# EAGLE schematic PGTN021_octasource_mkii_controls (EAGLE 9.6.0)
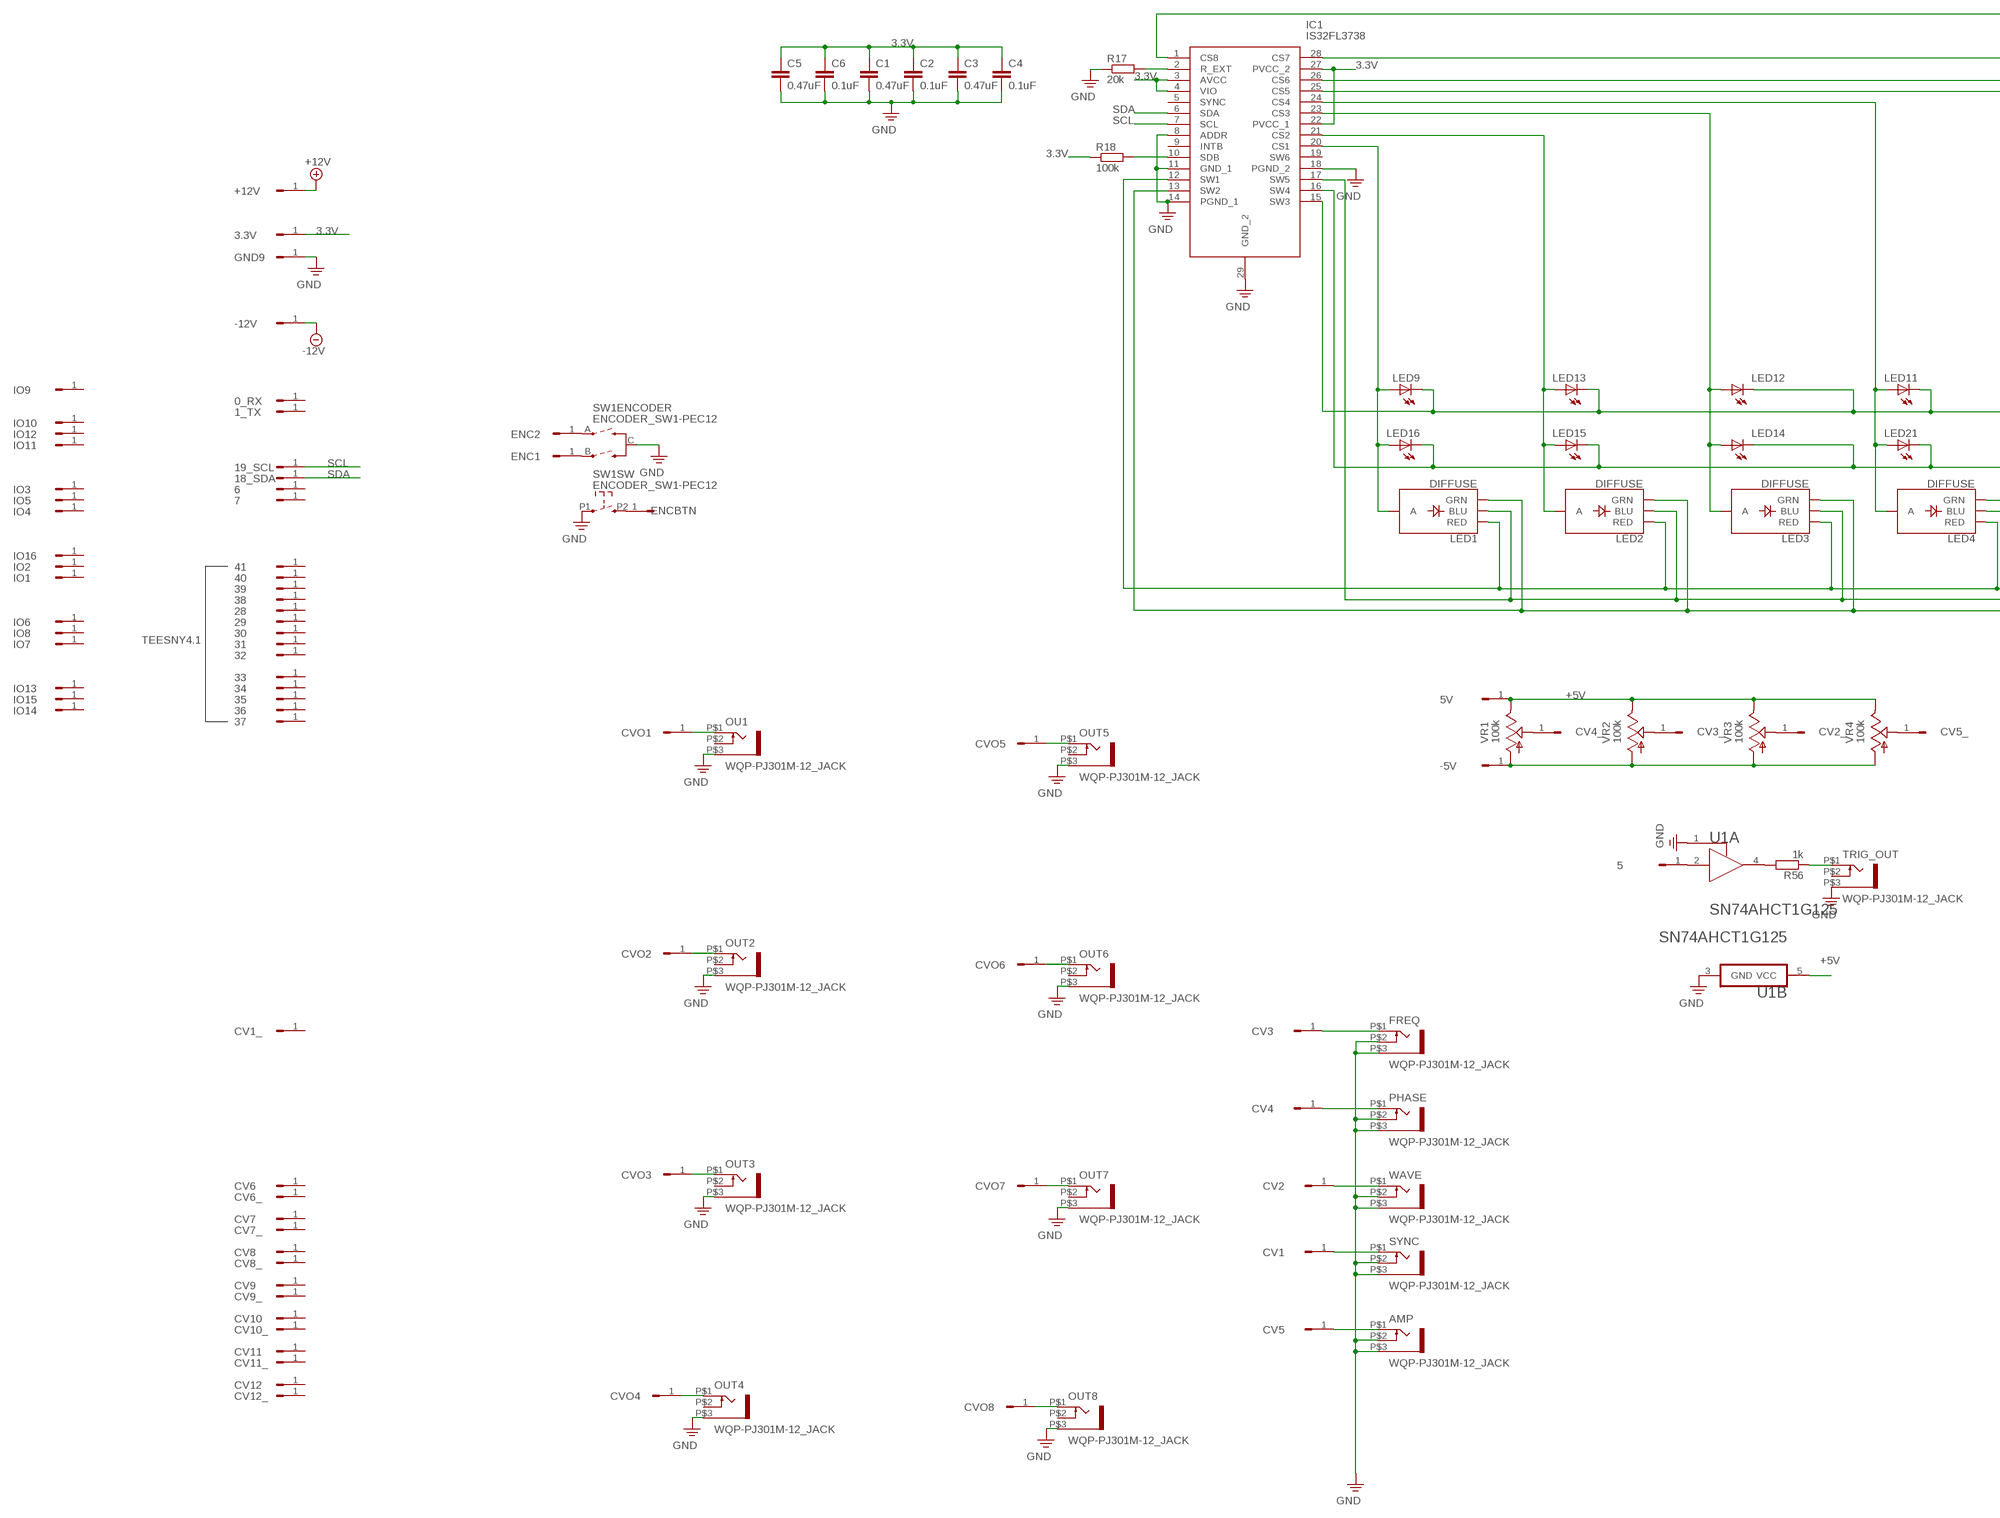
[diagram p0: schematic, sheet 1, part 1 of 2]
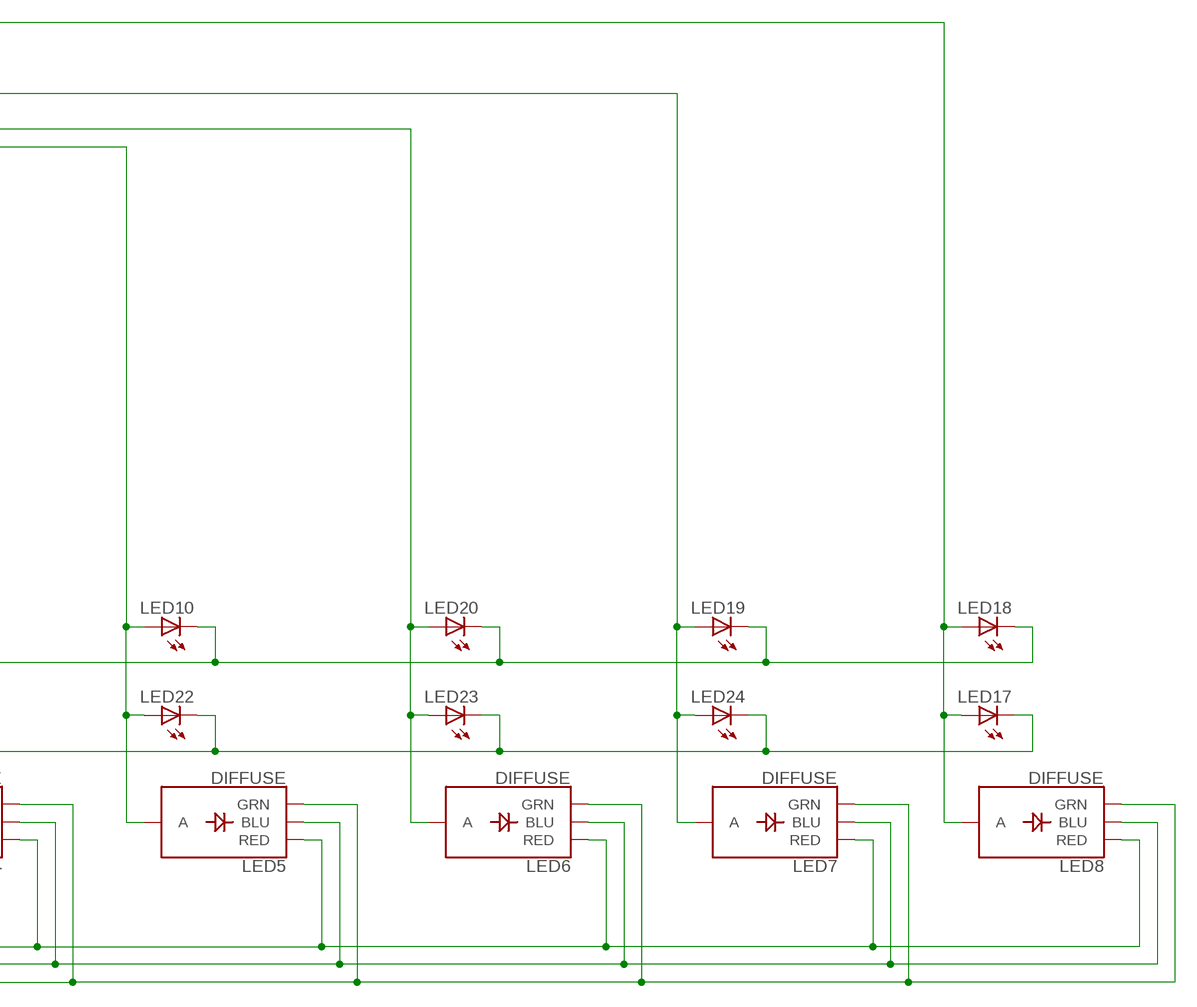
[diagram p1: schematic, sheet 1, part 2 of 2]

## Parts
0_RX  HEADER/MALE/01  [HEADER/MALE/01]
1_TX  HEADER/MALE/01  [HEADER/MALE/01]
3.3V  HEADER/MALE/01  [HEADER/MALE/01]
5  HEADER/MALE/01  [HEADER/MALE/01]
5V  HEADER/MALE/01  [HEADER/MALE/01]
6  HEADER/MALE/01  [HEADER/MALE/01]
7  HEADER/MALE/01  [HEADER/MALE/01]
18_SDA  HEADER/MALE/01  [HEADER/MALE/01]
19_SCL  HEADER/MALE/01  [HEADER/MALE/01]
28  HEADER/MALE/01  [HEADER/MALE/01]
29  HEADER/MALE/01  [HEADER/MALE/01]
30  HEADER/MALE/01  [HEADER/MALE/01]
31  HEADER/MALE/01  [HEADER/MALE/01]
32  HEADER/MALE/01  [HEADER/MALE/01]
33  HEADER/MALE/01  [HEADER/MALE/01]
34  HEADER/MALE/01  [HEADER/MALE/01]
35  HEADER/MALE/01  [HEADER/MALE/01]
36  HEADER/MALE/01  [HEADER/MALE/01]
37  HEADER/MALE/01  [HEADER/MALE/01]
38  HEADER/MALE/01  [HEADER/MALE/01]
39  HEADER/MALE/01  [HEADER/MALE/01]
40  HEADER/MALE/01  [HEADER/MALE/01]
41  HEADER/MALE/01  [HEADER/MALE/01]
+12V  HEADER/MALE/01  [HEADER/MALE/01]
-5V  HEADER/MALE/01  [HEADER/MALE/01]
-12V  HEADER/MALE/01  [HEADER/MALE/01]
AMP  WQP-PJ301M-12_JACK  [WQP-PJ301M-12_JACK]
C1  0.47uF  CAPACITORC0603  [C0603]
C2  0.1uF  CAPACITORC0603  [C0603]
C3  0.47uF  CAPACITORC0603  [C0603]
C4  0.1uF  CAPACITORC0603  [C0603]
C5  0.47uF  CAPACITORC0603  [C0603]
C6  0.1uF  CAPACITORC0603  [C0603]
CV1  HEADER/MALE/01  [HEADER/MALE/01]
CV1_  HEADER/MALE/01  [HEADER/MALE/01]
CV2  HEADER/MALE/01  [HEADER/MALE/01]
CV2_  HEADER/MALE/01  [HEADER/MALE/01]
CV3  HEADER/MALE/01  [HEADER/MALE/01]
CV3_  HEADER/MALE/01  [HEADER/MALE/01]
CV4  HEADER/MALE/01  [HEADER/MALE/01]
CV4_  HEADER/MALE/01  [HEADER/MALE/01]
CV5  HEADER/MALE/01  [HEADER/MALE/01]
CV5_  HEADER/MALE/01  [HEADER/MALE/01]
CV6  HEADER/MALE/01  [HEADER/MALE/01]
CV6_  HEADER/MALE/01  [HEADER/MALE/01]
CV7  HEADER/MALE/01  [HEADER/MALE/01]
CV7_  HEADER/MALE/01  [HEADER/MALE/01]
CV8  HEADER/MALE/01  [HEADER/MALE/01]
CV8_  HEADER/MALE/01  [HEADER/MALE/01]
CV9  HEADER/MALE/01  [HEADER/MALE/01]
CV9_  HEADER/MALE/01  [HEADER/MALE/01]
CV10  HEADER/MALE/01  [HEADER/MALE/01]
CV10_  HEADER/MALE/01  [HEADER/MALE/01]
CV11  HEADER/MALE/01  [HEADER/MALE/01]
CV11_  HEADER/MALE/01  [HEADER/MALE/01]
CV12  HEADER/MALE/01  [HEADER/MALE/01]
CV12_  HEADER/MALE/01  [HEADER/MALE/01]
CVO1  HEADER/MALE/01  [HEADER/MALE/01]
CVO2  HEADER/MALE/01  [HEADER/MALE/01]
CVO3  HEADER/MALE/01  [HEADER/MALE/01]
CVO4  HEADER/MALE/01  [HEADER/MALE/01]
CVO5  HEADER/MALE/01  [HEADER/MALE/01]
CVO6  HEADER/MALE/01  [HEADER/MALE/01]
CVO7  HEADER/MALE/01  [HEADER/MALE/01]
CVO8  HEADER/MALE/01  [HEADER/MALE/01]
ENC1  HEADER/MALE/01  [HEADER/MALE/01]
ENC2  HEADER/MALE/01  [HEADER/MALE/01]
ENCBTN  HEADER/MALE/01  [HEADER/MALE/01]
FREQ  WQP-PJ301M-12_JACK  [WQP-PJ301M-12_JACK]
GND9  HEADER/MALE/01  [HEADER/MALE/01]
IC1  IS32FL3738  [TSSOP29]
IO1  HEADER/MALE/01  [HEADER/MALE/01]
IO2  HEADER/MALE/01  [HEADER/MALE/01]
IO3  HEADER/MALE/01  [HEADER/MALE/01]
IO4  HEADER/MALE/01  [HEADER/MALE/01]
IO5  HEADER/MALE/01  [HEADER/MALE/01]
IO6  HEADER/MALE/01  [HEADER/MALE/01]
IO7  HEADER/MALE/01  [HEADER/MALE/01]
IO8  HEADER/MALE/01  [HEADER/MALE/01]
IO9  HEADER/MALE/01  [HEADER/MALE/01]
IO10  HEADER/MALE/01  [HEADER/MALE/01]
IO11  HEADER/MALE/01  [HEADER/MALE/01]
IO12  HEADER/MALE/01  [HEADER/MALE/01]
IO13  HEADER/MALE/01  [HEADER/MALE/01]
IO14  HEADER/MALE/01  [HEADER/MALE/01]
IO15  HEADER/MALE/01  [HEADER/MALE/01]
IO16  HEADER/MALE/01  [HEADER/MALE/01]
LED1  DIFFUSE  LED-RGB-CADIFFUSE  [LED-RGB-THRU]
LED2  DIFFUSE  LED-RGB-CADIFFUSE  [LED-RGB-THRU]
LED3  DIFFUSE  LED-RGB-CADIFFUSE  [LED-RGB-THRU]
LED4  DIFFUSE  LED-RGB-CADIFFUSE  [LED-RGB-THRU]
LED5  DIFFUSE  LED-RGB-CADIFFUSE  [LED-RGB-THRU]
LED6  DIFFUSE  LED-RGB-CADIFFUSE  [LED-RGB-THRU]
LED7  DIFFUSE  LED-RGB-CADIFFUSE  [LED-RGB-THRU]
LED8  DIFFUSE  LED-RGB-CADIFFUSE  [LED-RGB-THRU]
LED9  LEDCHIPLED_0805  [CHIPLED_0805]
LED10  LEDCHIPLED_0805  [CHIPLED_0805]
LED11  LEDCHIPLED_0805  [CHIPLED_0805]
LED12  LEDCHIPLED_0805  [CHIPLED_0805]
LED13  LEDCHIPLED_0805  [CHIPLED_0805]
LED14  LEDCHIPLED_0805  [CHIPLED_0805]
LED15  LEDCHIPLED_0805  [CHIPLED_0805]
LED16  LEDCHIPLED_0805  [CHIPLED_0805]
LED17  LEDCHIPLED_0805  [CHIPLED_0805]
LED18  LEDCHIPLED_0805  [CHIPLED_0805]
LED19  LEDCHIPLED_0805  [CHIPLED_0805]
LED20  LEDCHIPLED_0805  [CHIPLED_0805]
LED21  LEDCHIPLED_0805  [CHIPLED_0805]
LED22  LEDCHIPLED_0805  [CHIPLED_0805]
LED23  LEDCHIPLED_0805  [CHIPLED_0805]
LED24  LEDCHIPLED_0805  [CHIPLED_0805]
OU1  WQP-PJ301M-12_JACK  [WQP-PJ301M-12_JACK]
OUT2  WQP-PJ301M-12_JACK  [WQP-PJ301M-12_JACK]
OUT3  WQP-PJ301M-12_JACK  [WQP-PJ301M-12_JACK]
OUT4  WQP-PJ301M-12_JACK  [WQP-PJ301M-12_JACK]
OUT5  WQP-PJ301M-12_JACK  [WQP-PJ301M-12_JACK]
OUT6  WQP-PJ301M-12_JACK  [WQP-PJ301M-12_JACK]
OUT7  WQP-PJ301M-12_JACK  [WQP-PJ301M-12_JACK]
OUT8  WQP-PJ301M-12_JACK  [WQP-PJ301M-12_JACK]
PHASE  WQP-PJ301M-12_JACK  [WQP-PJ301M-12_JACK]
R17  20k  RESISTOR  [R0603]
R18  100k  RESISTOR  [R0603]
R56  1k  RESISTOR  [R0603]
SW1  ENCODER_SW1-PEC12  [PEC12_INCREMENTAL_ENCODER]
SYNC  WQP-PJ301M-12_JACK  [WQP-PJ301M-12_JACK]
TRIG_OUT  WQP-PJ301M-12_JACK  [WQP-PJ301M-12_JACK]
U1  74AHCT1G125"  [74AHCT1G125]
VR1  100k  9MM_SNAP-IN_POT_  [9MM_SNAP-IN_POT]
VR2  100k  9MM_SNAP-IN_POT_  [9MM_SNAP-IN_POT]
VR3  100k  9MM_SNAP-IN_POT_  [9MM_SNAP-IN_POT]
VR4  100k  9MM_SNAP-IN_POT_  [9MM_SNAP-IN_POT]
WAVE  WQP-PJ301M-12_JACK  [WQP-PJ301M-12_JACK]

## Nets
3.3V: 3.3V.1 C1.1 C2.1 C3.1 C4.1 C5.1 C6.1 IC1.3(AVCC) IC1.4(VIO) IC1.22(PVCC_1) IC1.27(PVCC_2) R18.1
+5V: 5V.1 U1.5(B:VCC) VR1.3(E) VR2.3(E) VR3.3(E) VR4.3(E)
+12V: +12V.1
-12V: -12V.1
N$1: IC1.12(SW1) LED1.1(RED) LED2.1(RED) LED3.1(RED) LED4.1(RED) LED5.1(RED) LED6.1(RED) LED7.1(RED) LED8.1(RED)
N$3: IC1.17(SW5) LED1.4(BLU) LED2.4(BLU) LED3.4(BLU) LED4.4(BLU) LED5.4(BLU) LED6.4(BLU) LED7.4(BLU) LED8.4(BLU)
N$4: CVO1.1 OU1.P$1
N$6: IC1.13(SW2) LED1.3(GRN) LED2.3(GRN) LED3.3(GRN) LED4.3(GRN) LED5.3(GRN) LED6.3(GRN) LED7.3(GRN) LED8.3(GRN)
N$8: CVO2.1 OUT2.P$1
N$12: CVO3.1 OUT3.P$1
N$16: CVO4.1 OUT4.P$1
N$20: CVO5.1 OUT5.P$1
N$24: CVO6.1 OUT6.P$1
N$28: CVO7.1 OUT7.P$1
N$32: CVO8.1 OUT8.P$1
N$33: IC1.10(SDB) R18.2
N$34: R56.2 U1.4(A:Y)
N$35: 5.1 U1.2(A:A)
N$36: ENCBTN.1 SW1.P2
N$37: ENC2.1 SW1.A(ENCODER:A)
N$38: ENC1.1 SW1.B(ENCODER:B)
N$39: CV1.1 SYNC.P$1
N$40: -5V.1 VR1.1(A) VR2.1(A) VR3.1(A) VR4.1(A)
N$41: CV2.1 WAVE.P$1
N$42: CV3.1 FREQ.P$1
N$43: CV4.1 PHASE.P$1
N$44: AMP.P$1 CV5.1
N$45: CV2_.1 VR3.2(S)
N$46: CV3_.1 VR2.2(S)
N$47: CV4_.1 VR1.2(S)
N$48: CV5_.1 VR4.2(S)
N$49: R56.1 TRIG_OUT.P$1
N$50: IC1.20(CS1) LED1.2(A) LED9.A LED16.A
N$51: IC1.21(CS2) LED2.2(A) LED13.A LED15.A
N$52: IC1.23(CS3) LED3.2(A) LED12.A LED14.A
N$62: IC1.16(SW4) LED14.C LED15.C LED16.C LED17.C LED21.C LED22.C LED23.C LED24.C
N$63: IC1.15(SW3) LED9.C LED10.C LED11.C LED12.C LED13.C LED18.C LED19.C LED20.C
N$65: IC1.24(CS4) LED4.2(A) LED11.A LED21.A
N$66: IC1.25(CS5) LED5.2(A) LED10.A LED22.A
N$67: IC1.26(CS6) LED6.2(A) LED20.A LED23.A
N$68: IC1.28(CS7) LED7.2(A) LED19.A LED24.A
N$69: IC1.1(CS8) LED8.2(A) LED17.A LED18.A
N$70: IC1.2(R_EXT) R17.2
PE: AMP.P$2 AMP.P$3 C1.2 C2.2 C3.2 C4.2 C5.2 C6.2 FREQ.P$2 FREQ.P$3 GND9.1 IC1.8(ADDR) IC1.11(GND_1) IC1.14(PGND_1) IC1.18(PGND_2) IC1.29(GND_2) OU1.P$3 OUT2.P$3 OUT3.P$3 OUT4.P$3 OUT5.P$3 OUT6.P$3 OUT7.P$3 OUT8.P$3 PHASE.P$2 PHASE.P$3 R17.1 SW1.C(ENCODER:C) SW1.P1 SYNC.P$2 SYNC.P$3 TRIG_OUT.P$3 U1.1(A:!OE!) U1.3(B:GND) WAVE.P$2 WAVE.P$3 ; supply symbol labelled GND
SCL: 19_SCL.1 IC1.7(SCL)
SDA: 18_SDA.1 IC1.6(SDA)
Unconnected: 0_RX.1 1_TX.1 6.1 7.1 28.1 29.1 30.1 31.1 32.1 33.1 34.1 35.1 36.1 37.1 38.1 39.1 40.1 41.1 CV1_.1 CV6.1 CV6_.1 CV7.1 CV7_.1 CV8.1 CV8_.1 CV9.1 CV9_.1 CV10.1 CV10_.1 CV11.1 CV11_.1 CV12.1 CV12_.1 IC1.5(SYNC) IC1.9(INTB) IC1.19(SW6) IO1.1 IO2.1 IO3.1 IO4.1 IO5.1 IO6.1 IO7.1 IO8.1 IO9.1 IO10.1 IO11.1 IO12.1 IO13.1 IO14.1 IO15.1 IO16.1 OU1.P$2 OUT2.P$2 OUT3.P$2 OUT4.P$2 OUT5.P$2 OUT6.P$2 OUT7.P$2 OUT8.P$2 TRIG_OUT.P$2

## Notes on the sheet
- TEESNY4.1

## Library data of the parts
0_RX 1_TX 3.3V 5 5V 6 7 18_SDA 19_SCL 28-41 +12V -5V -12V CV1 CV1_ CV2 CV2_ CV3 CV3_ CV4 CV4_ CV5 CV5_ CV6 CV6_ CV7 CV7_ CV8 CV8_ CV9 CV9_ CV10 CV10_ CV11 CV11_ CV12 CV12_ CVO1-CVO8 ENC1 ENC2 ENCBTN GND9 IO1-IO16 = connectors:HEADER/MALE/01; SPICEPREFIX: X
AMP FREQ OU1 OUT2-OUT8 PHASE SYNC TRIG_OUT WAVE = controls:WQP-PJ301M-12_JACK
C1-C6 = capacitors:CAPACITOR: CAPACITOR, European symbol
IC1 = ic_digital:IS32FL3738: IC LED DRIVER 6X8 28TSSOP Source: Datasheet <http://www.issi.com/WW/pdf/IS32FL3738.pdf>; DESCRIPTION: IC LED DRIVER 6X8 28TSSOP; HEIGHT: 1.2mm; MANUFACTURER_NAME: ISSI, Integrated Silicon Solution Inc; MANUFACTURER_PART_NUMBER: IS32FL3738-ZLA3-TR
LED1-LED8 = display_led:LED-RGB-CA: LED-RGB Diffused Common Anode Packages: LED RGB-THRU P-LCC-4-3 LED-TRICOLOR-SMD SparkFun Products: RGB Diffused Common Anode- Diffuse <[https://www.sparkfun.com/products/10821]> RGB Diffused Common Anode - Clear <[https://www.sparkfun.com/products/10820]> Qduino Mini <[https://www.sparkfun.com/products/13614]> Triple Output LED RGB - SMD <https://www.sparkfun.com/products/7844>; PROD_ID: DIO-10632
LED9-LED24 = display_led:LED: LED OSRAM: - CHIPLED LG R971, LG N971, LY N971, LG Q971, LY Q971, LO R971, LY R971 LH N974, LH R974 LS Q976, LO Q976, LY Q976 LO Q996 - Hyper CHIPLED LW Q18S LB Q993, LB Q99A, LB R99A - SideLED LS A670, LO A670, LY A670, LG A670, LP A670 LB A673, LV A673, LT A673, LW A673 LH A674 LY A675 LS A676, LA A676, LO A676, LY A676, LW A676 LS A679, LY A679, LG A679 - Hyper Micro SIDELED® LS Y876, LA Y876, LO Y876, LY Y876 LT Y87S - SmartLED LW L88C, LW L88S LB L89C, LB L89S, LG L890 LS L89K, LO L89K, LY L89K LS L896, LA L896, LO L896, LY L896 - TOPLED LS T670, LO T670, LY T670, LG T670, LP T670 LSG T670, LSP T670, LSY T670, LOP T670, LYG T670 LG T671, LOG T671, LSG T671 LB T673, LV T673, LT T673, LW T673 LH T674 LS T676, LA T676, LO T676, LY T676, LB T676, LH T676, LSB T676, LW T676 LB T67C, LV T67C, LT T67C, LS T67K, LO T67K, LY T67K, LW E67C LS E67B, LA E67B, LO E67B, LY E67B, LB E67C, LV E67C, LT E67C LW T67C LS T679, LY T679, LG T679 LS T770, LO T770, LY T770, LG T770, LP T770 LB T773, LV T773, LT T773, LW T773 LH T774 LS E675, LA E675, LY E675, LS T675 LS T776, LA T776, LO T776, LY T776, LB T776 LHGB T686 LT T68C, LB T68C - Hyper Mini TOPLED® LB M676 - Mini TOPLED Santana® LG M470 LS M47K, LO M47K, LY M47K Source: http://www.osram.convergy.de LUXEON: - LUMILED® LXK2-PW12-R00, LXK2-PW12-S00, LXK2-PW14-U00, LXK2-PW14-V00 LXK2-PM12-R00, LXK2-PM12-S00, LXK2-PM14-U00 LXK2-PE12-Q00, LXK2-PE12-R00, LXK2-PE12-S00, LXK2-PE14-T00, LXK2-PE14-U00 LXK2-PB12-K00, LXK2-PB12-L00, LXK2-PB12-M00, LXK2-PB14-N00, LXK2-PB14-P00, LXK2-PB14-Q00 LXK2-PR12-L00, LXK2-PR12-M00, LXK2-PR14-Q00, LXK2-PR14-R00 LXK2-PD12-Q00, LXK2-PD12-R00, LXK2-PD12-S00 LXK2-PH12-R00, LXK2-PH12-S00 LXK2-PL12-P00, LXK2-PL12-Q00, LXK2-PL12-R00 Source: www.luxeon.com KINGBRIGHT: KA-3528ASYC Source: www.kingbright.com
R17 R18 R56 = resistors:RESISTOR: RESISTOR, European symbol
SW1 = controls:ENCODER_SW1: Incremental Encoder with push switch
U1 = ic_digital:74AHCT1G125: TI-SN74AXXXX1X125-5; 3_STATE_OUTPUT: Yes; BITS: 1; CIIVA_IDS: 19361320; DATASHEET_VERSION: SCLS378M; FOOTPRINT_VARIANT_NAME_0: Level C; FOOTPRINT_VARIANT_NAME_1: Level B; FOOTPRINT_VARIANT_NAME_2: Level A; F__NOM_VOLTAGEMAXMHZ: 75; ICC__NOM_VOLTAGEMAXMA: 0.01; IMPORTED: yes; IMPORTED_FROM: vault; IMPORT_TS: 1521860152; INPUT_TYPE: CMOS; LOGIC: true; MF: Texas Instruments; MPN: SN74AHCT1G125; OPERATING_TEMPERATURE_RANGEC: -40 to 125; OUTPUT_DRIVE_IOLIOHMAXMA: 8/-8; OUTPUT_TYPE: CMOS; PACKAGE: DBV0005A; PIN_0_0_1_OUTSIDE_EDGE: dot; PREFIX: U; RATING: Catalog; RELEASE_DATE: 1459324136; SCHMITT_TRIGGER: No; SUB__FAMILY: Non-Inverting Buffer/Driver; TECHNOLOGY_FAMILY: AHCT; TPD__NOM_VOLTAGEMAXNS: 6; VAULT_GUID: D4F6E077-2F5C-4B23-8C12-AA7674079390; VAULT_REVISION: 30C08C77-DC7B-43EA-A3AC-F2B0253DD8E6; VCC_MAX_V: 5.5; VCC_MIN_V: 2; VOLTAGE_NOM_V: 5
VR1-VR4 = controls:9MM_SNAP-IN_POT: 9mm vertical snap-in pot, Alpha / Panasonic style